# EAGLE design relogioContador (EAGLE 9.3.0)
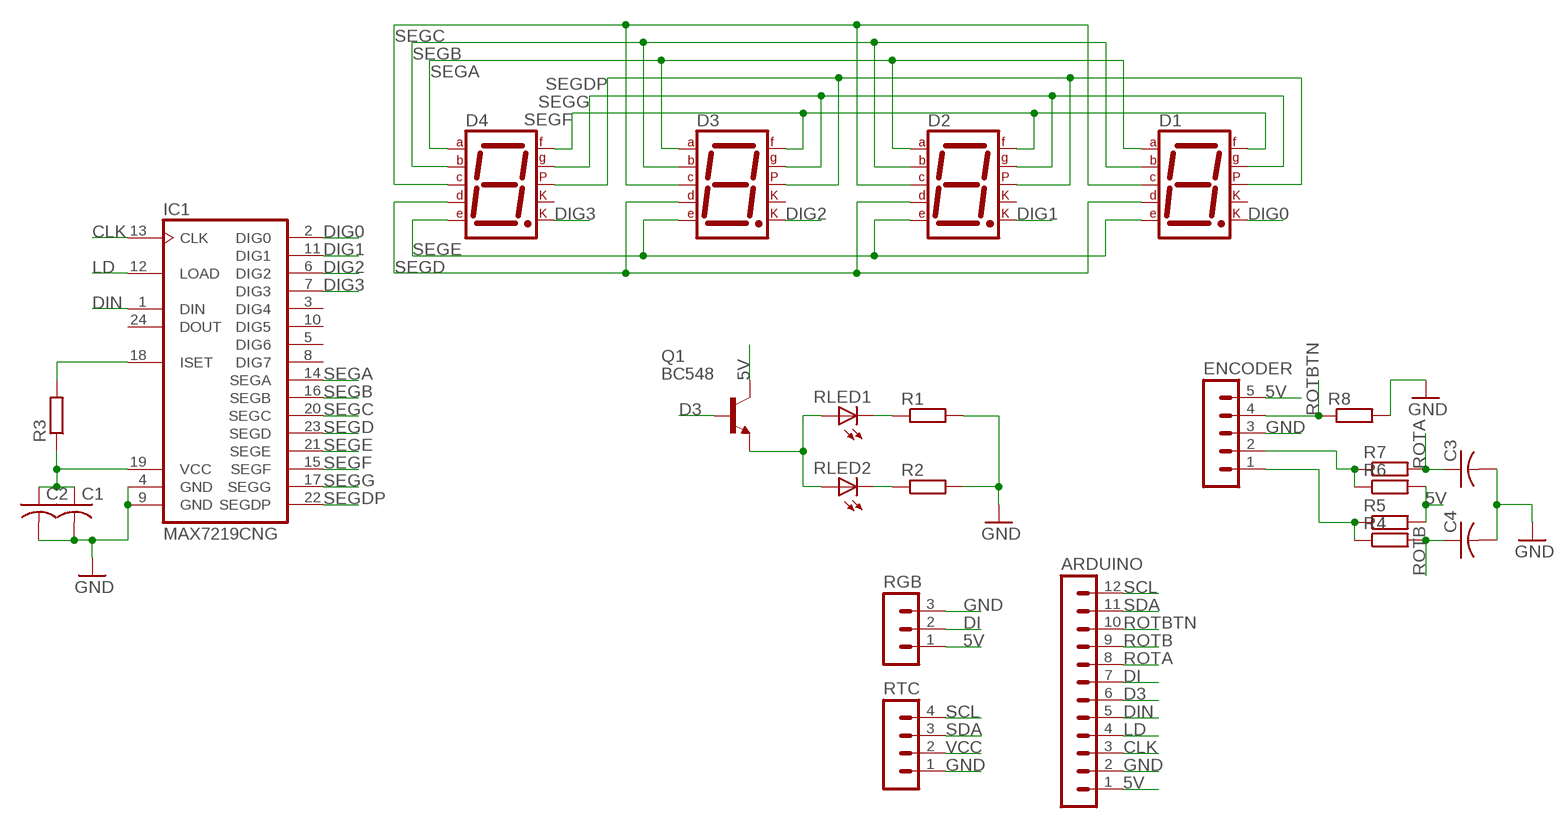
[diagram p0: schematic, sheet 1]

## Parts
ARDUINO  MA12-1  [MA12-1]
C1  C-US050-025X075  [C050-025X075]
C2  C-US050-025X075  [C050-025X075]
C3  C-US050-025X075  [C050-025X075]
C4  C-US050-025X075  [C050-025X075]
D1  7SEG-CK  [7SEG-13]
D2  7SEG-CK  [7SEG-13]
D3  7SEG-CK  [7SEG-13]
D4  7SEG-CK  [7SEG-13]
ENCODER  MA05-1  [MA05-1]
IC1  MAX7219CNG  [DIL24-3]
Q1  BC548  [TO92-EBC]
R1  R-EU_0411/15  [0411/15]
R2  R-EU_0411/15  [0411/15]
R3  R-EU_0411/15  [0411/15]
R4  R-EU_0411/15  [0411/15]
R5  R-EU_0411/15  [0411/15]
R6  R-EU_0411/15  [0411/15]
R7  R-EU_0411/15  [0411/15]
R8  R-EU_0411/15  [0411/15]
RGB  MA03-1  [MA03-1]
RLED1  LED3MM  [LED3MM]
RLED2  LED3MM  [LED3MM]
RTC  MA04-1  [MA04-1]

## Nets
5V: ARDUINO.1 ENCODER.5 Q1.C R5.2 R6.2 RGB.1
CLK: ARDUINO.3 IC1.13(CLK)
D3: ARDUINO.6 Q1.B
DI: ARDUINO.7 RGB.2
DIG0: D1.8(CK2) IC1.2(DIG0)
DIG1: D2.8(CK2) IC1.11(DIG1)
DIG2: D3.8(CK2) IC1.6(DIG2)
DIG3: D4.8(CK2) IC1.7(DIG3)
DIN: ARDUINO.5 IC1.1(DIN)
GND: ARDUINO.2 C1.2 C2.2 C3.2 C4.2 ENCODER.3 IC1.4(GND) IC1.9(GND) R1.2 R2.2 R8.2 RGB.3 RTC.1
LD: ARDUINO.4 IC1.12(LOAD)
N$1: R1.1 RLED1.K(C)
N$2: R2.1 RLED2.K(C)
N$4: Q1.E RLED1.A RLED2.A
N$5: ENCODER.2 R6.1 R7.1
N$6: C1.1 C2.1 IC1.19(VCC) R3.1
N$8: IC1.18(ISET) R3.2
N$9: ENCODER.1 R4.1 R5.1
ROTA: ARDUINO.8 C3.1 R7.2
ROTB: ARDUINO.9 C4.1 R4.2
ROTBTN: ARDUINO.10 ENCODER.4 R8.1
SCL: ARDUINO.12 RTC.4
SDA: ARDUINO.11 RTC.3
SEGA: D1.7(A) D2.7(A) D3.7(A) D4.7(A) IC1.14(SEGA)
SEGB: D1.6(B) D2.6(B) D3.6(B) D4.6(B) IC1.16(SEGB)
SEGC: D1.4(C) D2.4(C) D3.4(C) D4.4(C) IC1.20(SEGC)
SEGD: D1.2(D) D2.2(D) D3.2(D) D4.2(D) IC1.23(SEGD)
SEGDP: D1.5(DP) D2.5(DP) D3.5(DP) D4.5(DP) IC1.22(SEGDP)
SEGE: D1.1(E) D2.1(E) D3.1(E) D4.1(E) IC1.21(SEGE)
SEGF: D1.9(F) D2.9(F) D3.9(F) D4.9(F) IC1.15(SEGF)
SEGG: D1.10(G) D2.10(G) D3.10(G) D4.10(G) IC1.17(SEGG)
VCC: RTC.2
Unconnected: D1.3(CK1) D2.3(CK1) D3.3(CK1) D4.3(CK1) IC1.3(DIG4) IC1.5(DIG6) IC1.8(DIG7) IC1.10(DIG5) IC1.24(DOUT)

## Library data of the parts
ARDUINO = con-lstb:MA12-1: PIN HEADER; OC_FARNELL: unknown; OC_NEWARK: unknown
C1-C4 = adafruit:C-US: CAPACITOR, American symbol
D1-D4 = special:7SEG-CK: 7-segment DISPLAY single cathode, 13 mm
ENCODER = con-lstb:MA05-1: PIN HEADER; OC_FARNELL: unknown; OC_NEWARK: unknown
IC1 = maxim:MAX7219CNG: LED DISPLAY DRIVER; MF: MAXIM; MPN: MAX7219CNG; OC_FARNELL: 1523914; OC_NEWARK: 34C4018
Q1 = transistor-npn:BC548*: NPN Transistor
R1-R8 = resistor:R-EU_: RESISTOR, European symbol
RGB = con-lstb:MA03-1: PIN HEADER; OC_FARNELL: unknown; OC_NEWARK: unknown
RLED1 RLED2 = adafruit:LED: LED OSRAM: - CHIPLED LG R971, LG N971, LY N971, LG Q971, LY Q971, LO R971, LY R971 LH N974, LH R974 LS Q976, LO Q976, LY Q976 LO Q996 - Hyper CHIPLED LW Q18S LB Q993, LB Q99A, LB R99A - SideLED LS A670, LO A670, LY A670, LG A670, LP A670 LB A673, LV A673, LT A673, LW A673 LH A674 LY A675 LS A676, LA A676, LO A676, LY A676, LW A676 LS A679, LY A679, LG A679 - Hyper Micro SIDELED® LS Y876, LA Y876, LO Y876, LY Y876 LT Y87S - SmartLED LW L88C, LW L88S LB L89C, LB L89S, LG L890 LS L89K, LO L89K, LY L89K LS L896, LA L896, LO L896, LY L896 - TOPLED LS T670, LO T670, LY T670, LG T670, LP T670 LSG T670, LSP T670, LSY T670, LOP T670, LYG T670 LG T671, LOG T671, LSG T671 LB T673, LV T673, LT T673, LW T673 LH T674 LS T676, LA T676, LO T676, LY T676, LB T676, LH T676, LSB T676, LW T676 LB T67C, LV T67C, LT T67C, LS T67K, LO T67K, LY T67K, LW E67C LS E67B, LA E67B, LO E67B, LY E67B, LB E67C, LV E67C, LT E67C LW T67C LS T679, LY T679, LG T679 LS T770, LO T770, LY T770, LG T770, LP T770 LB T773, LV T773, LT T773, LW T773 LH T774 LS E675, LA E675, LY E675, LS T675 LS T776, LA T776, LO T776, LY T776, LB T776 LHGB T686 LT T68C, LB T68C - Hyper Mini TOPLED® LB M676 - Mini TOPLED Santana® LG M470 LS M47K, LO M47K, LY M47K Source: http://www.osram.convergy.de/
RTC = con-lstb:MA04-1: PIN HEADER; OC_FARNELL: unknown; OC_NEWARK: unknown

## Net classes
0 default: width 0.6 mm, drill 1 mm, clearance 0.5 mm

## Board
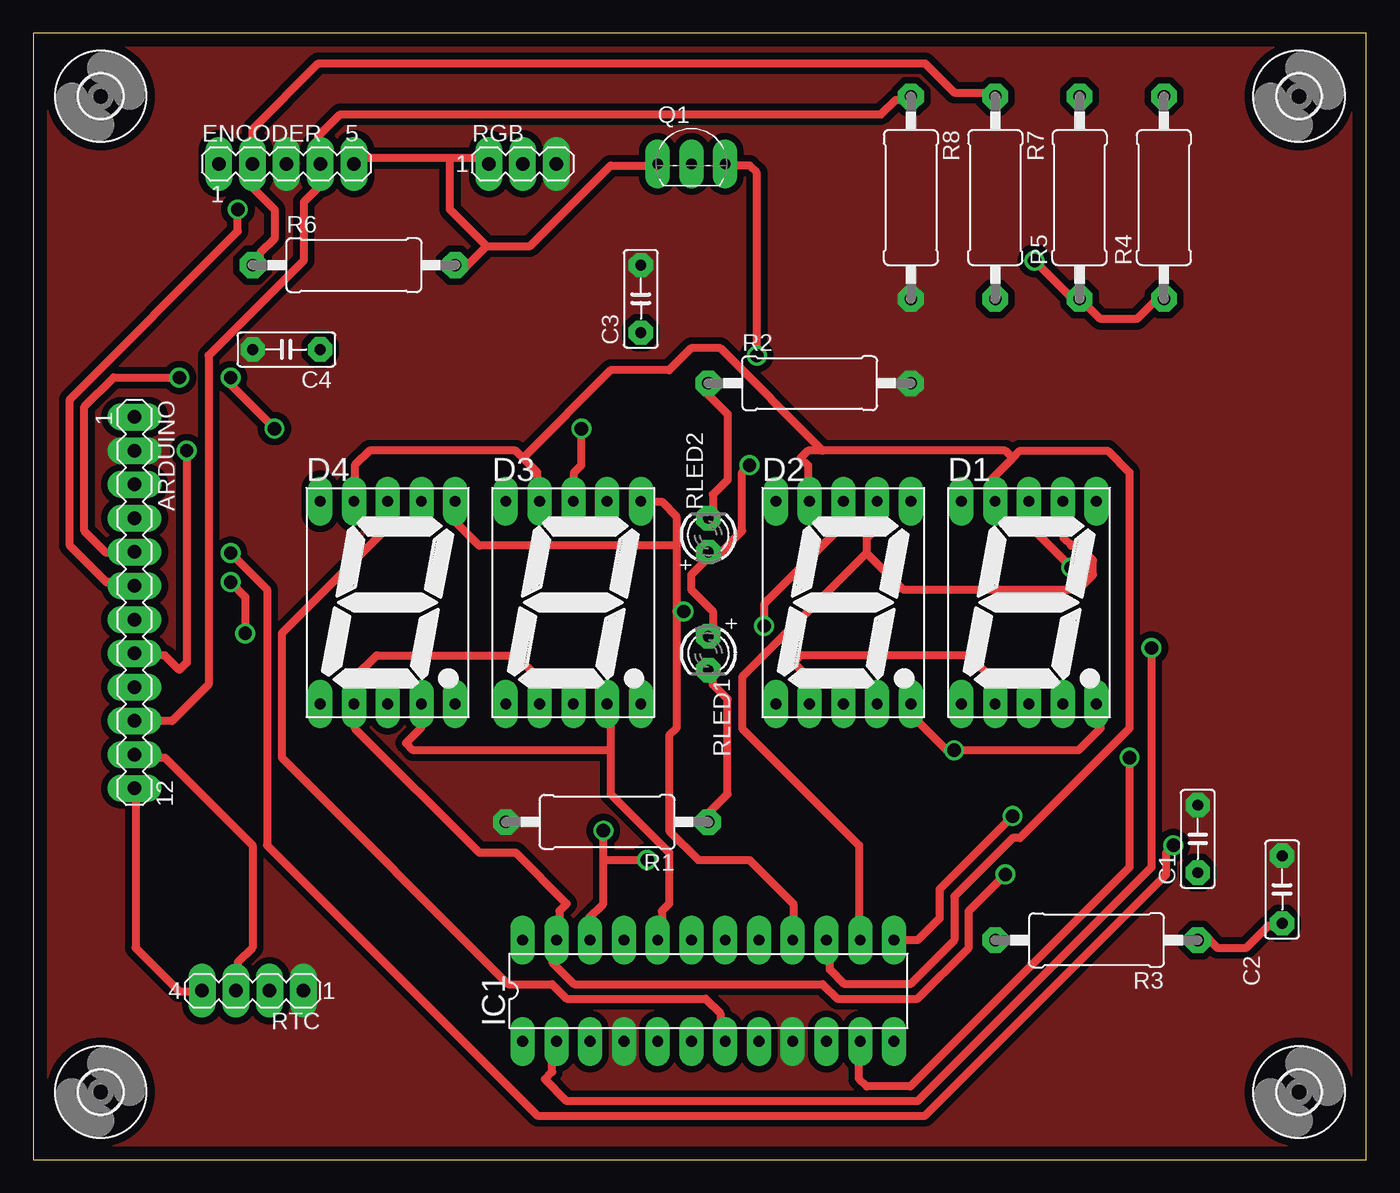
[diagram p1: board, top side]
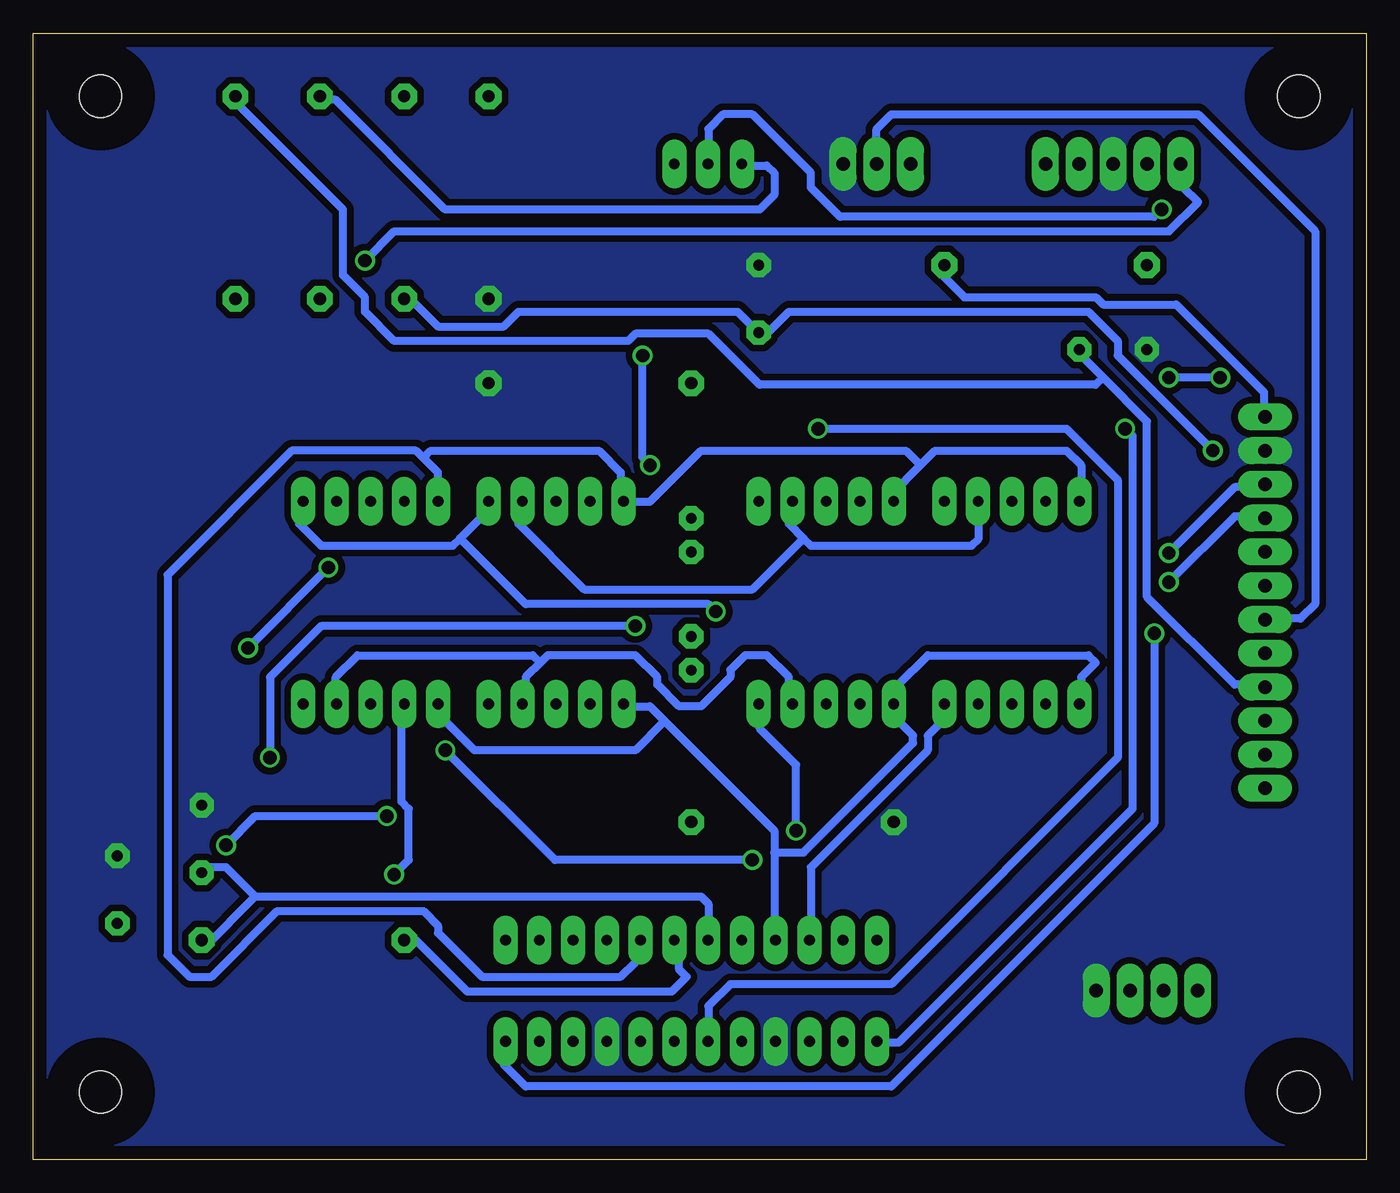
[diagram p2: board, bottom side, seen from below]

Size 100.31 x 84.76 mm. Coordinates in mm from the lower left corner, seen from the top.
Outline: 0,0 100.31,0 100.31,84.76 0,84.76 0,0
Copper layers (1*16): Top 0.035mm / dielectric 1.5mm / Bottom 0.035mm
Design rules "default *": minimum track width 6mil, minimum drill 0.35mm, track to track 6mil, track to pad 6mil, pad to pad 6mil, via to via 6mil, smd to smd 6mil, copper to edge 40mil, drill to drill 6mil, minimum pad ring 20mil, minimum via ring 8mil, stop-mask expansion 4mil, vias tented up to drill 0mil, thermal gap 0mil

### Footprints (pad centres in the part's own frame; a part is rotated, then mirrored left to right if it is on the bottom)
MA12-1 = drill 1.016 long: 1 -13.97,0; 2 -11.43,0; 3 -8.89,0; 4 -6.35,0; 5 -3.81,0; 6 -1.27,0; 7 1.27,0; 8 3.81,0; 9 6.35,0; 10 8.89,0; 11 11.43,0; 12 13.97,0
C050-025X075 = drill 0.813 octagon: 1 -2.54,0; 2 2.54,0
7SEG-13 = drill 0.813 long: 1 -5.08,-7.62; 2 -2.54,-7.62; 3 0,-7.62; 4 2.54,-7.62; 5 5.08,-7.62; 6 5.08,7.62; 7 2.54,7.62; 8 0,7.62; 9 -2.54,7.62; 10 -5.08,7.62
MA05-1 = drill 1.016 long: 1 -5.08,0; 2 -2.54,0; 3 0,0; 4 2.54,0; 5 5.08,0
DIL24-3 = drill 0.813 long: 1 -13.97,-3.81; 2 -11.43,-3.81; 3 -8.89,-3.81; 4 -6.35,-3.81; 5 -3.81,-3.81; 6 -1.27,-3.81; 7 1.27,-3.81; 8 3.81,-3.81; 9 6.35,-3.81; 10 8.89,-3.81; 11 11.43,-3.81; 12 13.97,-3.81; 13 13.97,3.81; 14 11.43,3.81; 15 8.89,3.81; 16 6.35,3.81; 17 3.81,3.81; 18 1.27,3.81; 19 -1.27,3.81; 20 -3.81,3.81; 21 -6.35,3.81; 22 -8.89,3.81; 23 -11.43,3.81; 24 -13.97,3.81
TO92-EBC = drill 0.813 long: B 0,-1.27; C -2.54,-1.27; E 2.54,-1.27
0411/15 = drill 0.914 octagon: 1 -7.62,0; 2 7.62,0
MA03-1 = drill 1.016 long: 1 -2.54,0; 2 0,0; 3 2.54,0
LED3MM = drill 0.813 pad 1.676 octagon: A -1.27,0; K 1.27,0
MA04-1 = drill 1.016 long: 1 -3.81,0; 2 -1.27,0; 3 1.27,0; 4 3.81,0
3,2 = hole 3.2: 0,0

### Placement (x,y rotation side)
ARDUINO  7.62,41.91 270 top
C1  87.63,24.13 90 top
C2  93.98,20.32 90 top
C3  45.72,64.77 90 top
C4  19.05,60.96 180 top
D1  74.93,41.91 0 top
D2  60.96,41.91 0 top
D3  40.64,41.91 0 top
D4  26.67,41.91 0 top
ENCODER  19.05,74.93 0 top
IC1  50.8,12.7 0 top
Q1  49.53,76.2 0 top
R1  43.18,25.4 180 top
R2  58.42,58.42 0 top
R3  80.01,16.51 180 top
R4  85.09,72.39 90 top
R5  78.74,72.39 90 top
R6  24.13,67.31 0 top
R7  72.39,72.39 270 top
R8  66.04,72.39 270 top
RGB  36.83,74.93 0 top
RLED1  50.8,38.1 270 top
RLED2  50.8,46.99 90 top
RTC  16.51,12.7 180 top
U$1  [3,2]  5.08,5.08 0 top
U$2  [3,2]  95.25,5.08 0 top
U$3  [3,2]  95.25,80.01 0 top
U$4  [3,2]  5.08,80.01 0 top

### Tracks (layer width: path | path; a pad name or v marks a point on that pad's centre or on a via)
5V
  Top 0.6: 31.35,75.35 34.1,75.35 RGB.1 | 31.35,75.35 24.2,75.35 ENCODER.5 | 34.1,68.75 37.4,68.75 43.45,74.8 46.75,74.8 Q1.C | 34.1,68.75 32.45,67.1 31.9,67.1 R6.2 | 31.35,75.35 31.35,71.5 34.1,68.75
  Bottom 0.6: R5.2 78.65,79.75 77.55,79.75 69.3,71.5 45.65,71.5 44.55,72.6 44.55,74.25 45.1,74.8 46.75,74.8 Q1.C | ARDUINO.1 7.7,56.1 7.7,57.75 14.3,64.35 19.8,64.35 20.35,64.9 30.25,64.9 31.9,66.55 31.9,67.1 R6.2
CLK  (via drill 1)
  Top 0.6: v73.7,25.85 68.2,20.35 68.2,18.15 66.55,16.5 64.9,16.5 IC1.13 | v85.8,23.65 85.25,23.1 85.25,21.45 67.1,3.3 37.95,3.3 17.6,23.65 17.6,42.9 v14.85,45.65
  Bottom 0.6: v73.7,25.85 83.6,25.85 v85.8,23.65 | v14.85,45.65 9.9,50.6 7.7,50.6 ARDUINO.3
D3  (via drill 1)
  Top 0.6: v15.4,71.5 15.4,69.85 2.75,57.2 2.75,46.2 5.5,43.45 7.15,43.45 ARDUINO.6
  Bottom 0.6: v15.4,71.5 15.95,70.95 39.6,70.95 41.8,73.15 41.8,74.25 46.2,78.65 48.4,78.65 49.5,77.55 49.5,75.35 Q1.B
DI
  Bottom 0.6: ARDUINO.7 7.15,40.7 4.95,40.7 3.85,41.8 3.85,69.85 12.65,78.65 35.75,78.65 36.85,77.55 36.85,75.35 RGB.2
DIG0  (via drill 1)
  Top 0.6: v84.15,38.5 84.15,22 66.55,4.4 40.15,4.4 38.5,6.05 39.05,6.6 39.05,8.8 IC1.2 | v78.1,44.55 74.8,47.85 74.8,49.5 D1.8
  Bottom 0.6: v78.1,44.55 v84.15,38.5
DIG1  (via drill 1)
  Top 0.6: v82.5,30.25 82.5,22 66,5.5 62.7,5.5 62.15,6.05 62.15,8.8 IC1.11 | v55,40.15 55,41.8 61.05,47.85 61.05,49.5 D2.8
  Bottom 0.6: v82.5,30.25 82.5,36.3 78.65,40.15 v55,40.15
DIG2  (via drill 1)
  Top 0.6: v41.25,55 41.25,52.25 40.7,51.7 40.7,50.05 D3.8
  Bottom 0.6: v41.25,55 22.55,55 18.7,51.15 18.7,30.25 35.75,13.2 47.85,13.2 49.5,11.55 49.5,9.35 IC1.6
DIG3
  Top 0.6: IC1.7 51.7,9.35 51.7,11 50.6,12.1 40.15,12.1 39.05,13.2 35.75,13.2 18.7,30.25 18.7,39.6 26.95,47.85 26.95,49.5 D4.8
DIN  (via drill 1)
  Top 0.6: v18.15,55 14.85,58.3 v14.85,58.85 | v11,58.85 6.05,58.85 3.85,56.65 3.85,47.3 5.5,45.65 7.15,45.65 ARDUINO.5
  Bottom 0.6: v18.15,55 17.6,54.45 17.6,26.4 35.2,8.8 36.3,8.8 IC1.1 | v11,58.85 v14.85,58.85
GND
  pour Bottom: 0,0 107.95,0 107.95,88.9 0,88.9
  pour Top: 0,0 114.3,0 114.3,92.71 0,92.71
LD  (via drill 1)
  Top 0.6: v15.95,39.6 15.95,42.35 v14.85,43.45
  Bottom 0.6: v15.95,39.6 15.95,25.3 35.75,5.5 63.25,5.5 64.9,7.15 64.9,8.8 IC1.12 | v14.85,43.45 9.9,48.4 7.7,48.4 ARDUINO.4
N$1
  Top 0.6: RLED1.K 51.15,36.3 51.15,35.75 52.25,34.65 52.25,27.5 50.6,25.85 R1.1
N$2
  Top 0.6: RLED2.K 51.15,48.4 51.15,50.05 52.25,51.15 52.25,56.1 50.6,57.75 50.6,58.3 R2.1
N$4  (via drill 1)
  Top 0.6: 51.15,45.65 49.5,44 49.5,42.9 51.15,41.25 51.15,39.6 RLED1.A | v54.45,60.5 54.45,74.25 53.9,74.8 52.25,74.8 Q1.E | v53.9,52.25 53.35,51.7 53.35,47.3 51.7,45.65 51.15,45.65 | 51.15,45.65 RLED2.A
  Bottom 0.6: v54.45,60.5 54.45,52.8 v53.9,52.25
N$5
  Top 0.6: R6.1 17.05,67.65 17.05,68.2 18.15,69.3 18.15,71.5 16.5,73.15 16.5,74.8 ENCODER.2 16.5,75.35 16.5,77.55 21.45,82.5 67.1,82.5 69.3,80.3 72.05,80.3 R7.1
N$6
  Top 0.6: C2.1 93.5,17.6 92.95,17.6 91.3,15.95 89.1,15.95 88,17.05 R3.1
  Bottom 0.6: 83.6,19.8 50.05,19.8 49.5,19.25 49.5,17.05 IC1.19 | 83.6,19.8 87.45,15.95 88,16.5 R3.1 | 83.6,19.8 85.8,22 87.45,22 C1.1
N$8
  Bottom 0.6: IC1.18 51.7,16.5 51.7,14.3 51.15,13.75 52.25,12.65 67.65,12.65 72.05,17.05 R3.2
N$9  (via drill 1)
  Top 0.6: R4.1 84.7,64.9 83.05,63.25 80.3,63.25 79.2,64.35 R5.1 78.65,64.35 v75.35,67.65
  Bottom 0.6: v75.35,67.65 73.15,69.85 14.85,69.85 12.65,72.05 13.75,73.15 13.75,74.8 ENCODER.1
ROTA  (via drill 1)
  Top 0.6: v11.55,53.35 11.55,37.4 11,36.85 9.9,37.95 7.7,37.95 ARDUINO.8
  Bottom 0.6: R7.2 72.05,64.9 69.85,62.7 64.9,62.7 63.8,63.8 47.3,63.8 46.2,62.7 C3.1 45.65,62.15 45.1,62.15 43.45,63.8 20.9,63.8 18.7,61.6 18.7,60.5 v11.55,53.35
ROTB
  Bottom 0.6: 19.8,58.85 16.5,55.55 16.5,42.35 9.9,35.75 7.7,35.75 ARDUINO.9 | 19.8,58.85 21.45,60.5 C4.1 | 19.8,58.85 20.35,58.3 45.65,58.3 49.5,62.15 55,62.15 55.55,61.6 73.15,61.6 75.35,63.8 75.35,64.9 77,66.55 77,71.5 84.7,79.2 84.7,79.75 R4.2
ROTBTN
  Top 0.6: R8.1 66,79.75 64.9,79.75 63.8,78.65 23.1,78.65 21.45,77 21.45,75.35 ENCODER.4 21.45,74.8 21.45,73.15 20.35,72.05 20.35,67.65 13.2,60.5 13.2,35.75 10.45,33 7.7,33 ARDUINO.10
SCL
  Top 0.6: RTC.4 12.65,12.65 11,12.65 7.7,15.95 7.7,27.5 ARDUINO.12
SDA
  Top 0.6: RTC.3 15.4,13.2 15.4,14.85 16.5,15.95 16.5,23.65 9.9,30.25 7.7,30.25 ARDUINO.11
SEGA
  Top 0.6: 62.7,45.65 53.35,36.3 53.35,32.45 62.15,23.65 62.15,17.05 IC1.14 | 62.7,45.65 62.7,46.75 63.8,47.85 63.8,49.5 D2.7 | 62.7,45.65 65.45,42.9 78.65,42.9 79.75,44 79.75,45.1 78.65,46.2 78.1,46.2 77.55,46.75 77.55,49.5 D1.7
  Bottom 0.6: 42.35,46.75 43.45,47.85 43.45,49.5 D3.7 | 42.35,46.75 41.8,46.2 29.7,46.2 29.15,46.75 29.15,49.5 D4.7 | 42.35,46.75 46.2,42.9 58.85,42.9 63.8,47.85 63.8,49.5 D2.7
SEGB  (via drill 1)
  Top 0.6: 48.4,46.2 48.4,48.4 47.3,49.5 46.2,49.5 D3.6 | 48.4,46.2 48.4,41.25 | 48.4,41.25 48.4,32.45 47.85,31.9 47.85,24.75 50.05,22.55 53.9,22.55 57.2,19.25 57.2,17.05 IC1.16 | 48.4,46.2 33.55,46.2 31.9,47.85 31.9,49.5 D4.6 | 48.4,41.25 v48.95,41.25
  Bottom 0.6: 68.2,46.75 68.75,46.2 78.65,46.2 80.3,47.85 80.3,49.5 D1.6 | 68.2,46.75 66.55,48.4 66.55,49.5 D2.6 | 68.2,46.75 63.25,41.8 49.5,41.8 v48.95,41.25
SEGC
  Top 0.6: 43.45,30.8 43.45,34.1 D3.4 | 43.45,30.8 43.45,27.5 47.85,23.1 47.85,19.25 47.3,18.7 47.3,17.05 IC1.20 | 43.45,30.8 28.6,30.8 28.05,31.35 29.15,32.45 29.15,34.1 D4.4
  Bottom 0.6: 62.15,37.4 63.25,36.3 63.25,34.65 D2.4 | 62.15,37.4 62.7,37.95 75.9,37.95 77.55,36.3 77.55,34.65 D1.4 | 62.15,37.4 61.6,37.95 55,37.95 53.35,36.3 53.35,35.75 51.7,34.1 50.05,34.1 47.85,36.3 47.85,36.85 46.75,37.95 45.1,37.95 43.45,36.3 43.45,34.65 D3.4
SEGD  (via drill 1)
  Top 0.6: D2.2 58.3,34.65 58.3,36.3 57.2,37.4 57.75,37.95 70.4,37.95 72.6,35.75 72.6,34.65 D1.2 | D3.2 37.95,34.65 37.95,36.3 36.3,37.95 25.85,37.95 24.2,36.3 24.2,34.65 D4.2 24.2,34.1 24.2,32.45 33.55,23.1 36.3,23.1 40.15,19.25 39.6,18.7 39.6,17.05 IC1.23 39.05,16.5 39.05,14.85 40.7,13.2 59.4,13.2 60.5,12.1 66.55,12.1 70.4,15.95 70.4,18.7 v73.15,21.45
  Bottom 0.6: v73.15,21.45 72.05,22.55 72.05,26.4 72.6,26.95 72.6,34.1 D1.2
SEGDP  (via drill 1)
  Top 0.6: D2.5 66.55,34.1 66.55,33 68.75,30.8 v69.3,30.8 78.65,30.8 80.3,32.45 80.3,34.1 D1.5 | 42.9,22.55 42.9,19.25 41.8,18.15 41.8,17.05 IC1.22 | 42.9,22.55 v42.9,24.75 | 42.9,22.55 v46.2,22.55
  Bottom 0.6: IC1.22 41.8,17.05 41.8,22 33,30.8 33,31.9 31.9,33 31.9,34.1 D4.5 | v42.9,24.75 42.9,29.7 45.65,32.45 45.65,34.1 D3.5 | v69.3,30.8 61.05,22.55 v46.2,22.55
SEGE
  Bottom 0.6: D4.1 21.45,34.65 21.45,36.3 20.35,37.4 20.9,37.95 33,37.95 35.2,35.75 35.2,34.65 D3.1 35.2,34.1 35.2,33 34.1,31.9 34.1,31.35 42.35,23.1 44.55,23.1 | 44.55,23.1 44.55,24.75 52.8,33 | 44.55,23.1 44.55,17.05 IC1.21 | 52.8,33 53.9,34.1 55.55,34.1 D2.1 | D1.1 69.85,33.55 67.1,30.8 55,30.8 52.8,33
SEGF
  Top 0.6: 36.85,52.8 37.95,51.7 37.95,50.05 D3.9 | 36.85,52.8 36.3,53.35 25.3,53.35 24.2,52.25 24.2,50.05 D4.9 | 73.7,52.8 72.05,51.15 72.05,50.05 D1.9 | 73.7,52.8 74.25,53.35 80.85,53.35 82.5,51.7 82.5,32.45 74.25,24.2 73.7,24.2 69.3,19.8 69.3,16.5 66,13.2 61.05,13.2 59.95,14.3 59.95,16.5 IC1.15 | 59.4,53.35 73.15,53.35 73.7,52.8 | 59.4,53.35 58.3,53.35 57.75,52.8 58.3,52.25 58.3,50.05 D2.9 | 36.85,52.8 43.45,59.4 47.85,59.4 49.5,61.05 51.7,61.05 59.4,53.35
SEGG
  Bottom 0.6: 33.55,52.25 35.75,50.05 D3.10 | 33.55,52.25 32.45,53.35 22.55,53.35 21.45,52.25 21.45,50.05 D4.10 | 70.95,52.8 69.85,51.7 D1.10 | 70.95,52.8 71.5,53.35 80.85,53.35 90.2,44 90.2,15.4 88.55,13.75 86.9,13.75 81.95,18.7 70.95,18.7 69.85,17.6 69.85,17.05 66.55,13.75 56.1,13.75 55,14.85 55,16.5 IC1.17 | 70.95,52.8 70.4,53.35 57.75,53.35 56.1,51.7 56.1,50.05 D2.10 55.55,49.5 53.9,49.5 50.05,53.35 34.65,53.35 33.55,52.25